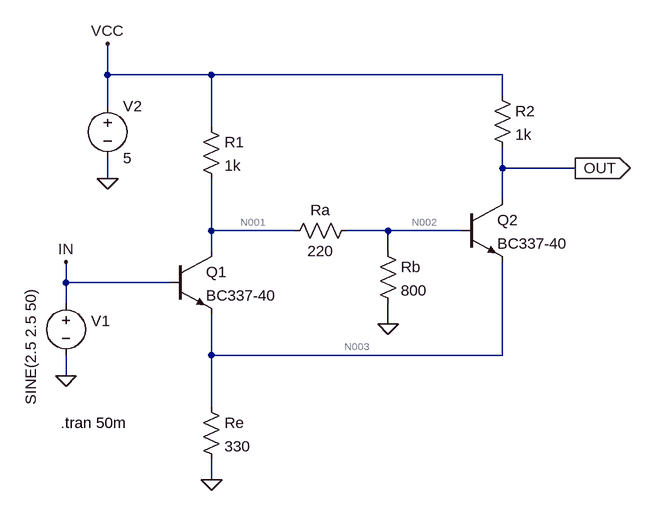
[diagram p0: schematic SchmittTrigger_Transistor_v1.0.asc]
SchmittTrigger_Transistor_v1.0.asc, the LTspice schematic file:
Version 4.1
SHEET 1 892 680
WIRE 64 -112 64 -160
WIRE 224 -112 64 -112
WIRE 672 -112 224 -112
WIRE 672 -80 672 -112
WIRE 64 -64 64 -112
WIRE 224 -32 224 -112
WIRE 672 32 672 0
WIRE 784 32 672 32
WIRE 64 48 64 16
WIRE 672 80 672 32
WIRE 224 128 224 48
WIRE 352 128 224 128
WIRE 496 128 432 128
WIRE 608 128 496 128
WIRE 224 160 224 128
WIRE 496 160 496 128
WIRE 0 208 0 176
WIRE 160 208 0 208
WIRE 0 240 0 208
WIRE 496 272 496 240
WIRE 224 320 224 256
WIRE 672 320 672 176
WIRE 672 320 224 320
WIRE 0 352 0 320
WIRE 224 400 224 320
WIRE 224 512 224 480
FLAG 0 352 0
FLAG 64 48 0
FLAG 64 -160 VCC
FLAG 496 272 0
FLAG 224 512 0
FLAG 0 176 IN
FLAG 784 32 OUT
IOPIN 784 32 Out
SYMBOL npn 160 160 R0
SYMATTR InstName Q1
SYMATTR Value BC337-40
SYMBOL res 208 -48 R0
SYMATTR InstName R1
SYMATTR Value 1k
SYMBOL res 208 384 R0
SYMATTR InstName Re
SYMATTR Value 330
SYMBOL res 448 112 R90
WINDOW 0 0 56 VBottom 2
WINDOW 3 32 56 VTop 2
SYMATTR InstName Ra
SYMATTR Value 220
SYMBOL res 480 144 R0
SYMATTR InstName Rb
SYMATTR Value 800
SYMBOL npn 608 80 R0
SYMATTR InstName Q2
SYMATTR Value BC337-40
SYMBOL res 656 -96 R0
SYMATTR InstName R2
SYMATTR Value 1k
SYMBOL voltage 0 224 R0
WINDOW 0 39 43 Left 2
WINDOW 3 -54 -8 VRight 2
WINDOW 123 0 0 Left 0
WINDOW 39 0 0 Left 0
SYMATTR InstName V1
SYMATTR Value SINE(2.5 2.5 50)
SYMBOL voltage 64 -80 R0
WINDOW 123 0 0 Left 0
WINDOW 39 0 0 Left 0
SYMATTR InstName V2
SYMATTR Value 5
TEXT -8 424 Left 2 !.tran 50m

The netlist it stands for:
* SchmittTrigger_Transistor_v1.0.asc
Q1 N001 IN N003 0 BC337-40
R1 VCC N001 1k
Re N003 0 330
Ra N002 N001 220
Rb N002 0 800
Q2 OUT N002 N003 0 BC337-40
R2 VCC OUT 1k
V1 IN 0 SINE(2.5 2.5 50)
V2 VCC 0 5
.model NPN NPN
.model PNP PNP
.lib standard.bjt
.tran 50m
.backanno
.end

* Results of the author's LTspice run, read from the files saved beside the schematic
* Operating Point, zero values left out:
*   V(in) = 2.5 V
*   V(n001) = 1.717 V
*   V(n002) = 1.347 V
*   V(n003) = 1.714 V
*   V(out) = 5 V
*   V(vcc) = 5 V
*   I(R1) = 3.283 mA
*   I(R2) = 3.725 pA
*   I(Ra) = -1.683 mA
*   I(Rb) = 1.683 mA
*   I(Re) = 5.193 mA
*   I(V1) = -3.593 mA
*   I(V2) = -3.283 mA
*   Ib(Q1) = 3.593 mA
*   Ib(Q2) = -4.091 pA
*   Ic(Q1) = 1.6 mA
*   Ic(Q2) = 3.723 pA
*   Ie(Q1) = -5.193 mA
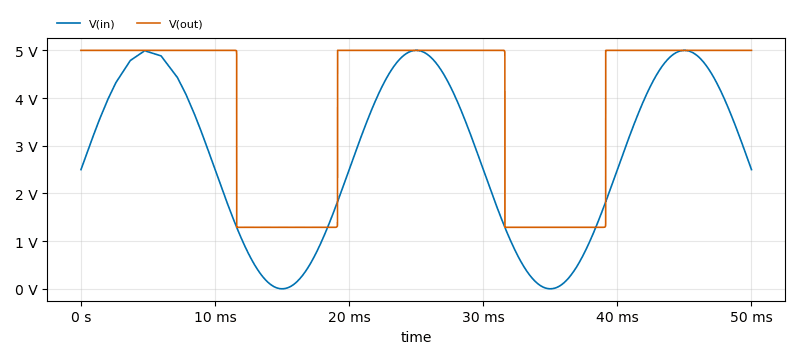
[diagram p1: Transient Analysis of SchmittTrigger_Transistor_v1.0.asc, plotted from the saved traces]
* Transient Analysis, 1 run:
*   V(in): min 9.068 µV, max 5 V, average 2.816 V, rms 3.309 V, last 2.5 V
*   V(out): min 1.289 V, max 5 V, average 3.884 V, rms 4.241 V, last 5 V